# EAGLE design ESP-01 Breakout (EAGLE 7.5.0)
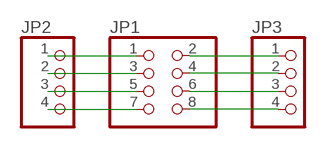
[diagram p0: schematic, sheet 1]

## Parts
JP1  PINHD-2X4  [2X04]
JP2  PINHD-1X4  [1X04]
JP3  PINHD-1X4  [1X04]

## Nets
N$1: JP1.1 JP2.1
N$2: JP1.3 JP2.2
N$3: JP1.5 JP2.3
N$4: JP1.7 JP2.4
N$5: JP1.2 JP3.1
N$6: JP1.4 JP3.2
N$7: JP1.6 JP3.3
N$8: JP1.8 JP3.4

## Library data of the parts
JP1 = pinhead:PINHD-2X4: PIN HEADER
JP2 JP3 = pinhead:PINHD-1X4: PIN HEADER

## Board
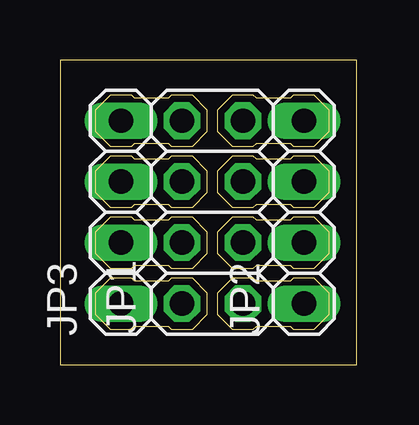
[diagram p1: board, top side]
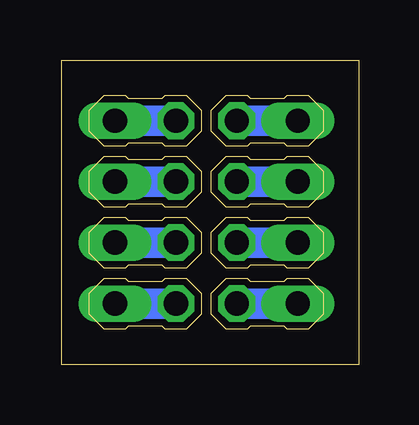
[diagram p2: board, bottom side, seen from below]

Size 12.37 x 12.69 mm. Coordinates in mm from the lower left corner, seen from the top.
Outline: 0,0 12.37,0 12.37,12.69 0,12.69 0,0
Copper layers (1*16): Top 0.035mm / dielectric 1.5mm / Bottom 0.035mm
Design rules "default": minimum track width 10mil, minimum drill 24mil, track to track 8mil, track to pad 8mil, pad to pad 8mil, via to via 8mil, smd to smd 8mil, copper to edge 40mil, drill to drill 8mil, minimum pad ring 10mil, minimum via ring 8mil, stop-mask expansion 4mil, vias tented up to drill 0mil, thermal gap 10mil
Milling: 128 lines

### Footprints (pad centres in the part's own frame; a part is rotated, then mirrored left to right if it is on the bottom)
2X04 = drill 1.016 octagon: 1 -3.81,-1.27; 2 -3.81,1.27; 3 -1.27,-1.27; 4 -1.27,1.27; 5 1.27,-1.27; 6 1.27,1.27; 7 3.81,-1.27; 8 3.81,1.27
1X04 = drill 1.016 long: 1 -3.81,0; 2 -1.27,0; 3 1.27,0; 4 3.81,0

### Placement (x,y rotation side)
JP1  6.35,6.35 90 top
JP2  10.16,6.35 90 top
JP3  2.54,6.35 90 top

### Tracks (layer width: path | path; a pad name or v marks a point on that pad's centre or on a via)
N$1
  Bottom 1.27: JP1.1 JP2.1
N$2
  Bottom 1.27: JP2.2 JP1.3
N$3
  Bottom 1.27: JP1.5 JP2.3
N$4
  Bottom 1.27: JP2.4 JP1.7
N$5
  Bottom 1.27: JP1.2 JP3.1
N$6
  Bottom 1.27: JP3.2 JP1.4
N$7
  Bottom 1.27: JP1.6 JP3.3
N$8
  Bottom 1.27: JP3.4 JP1.8